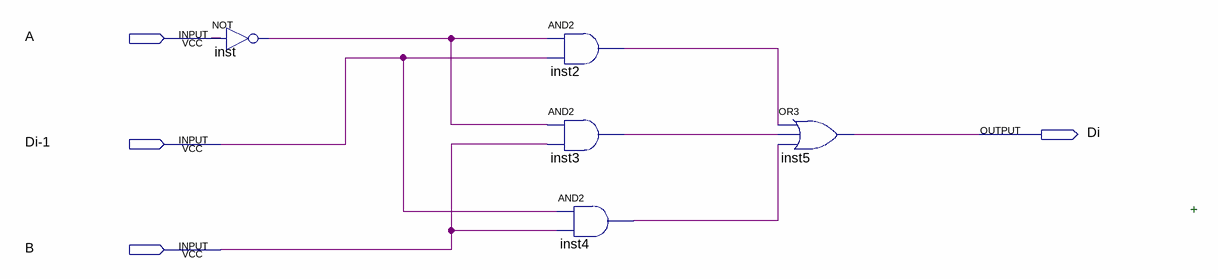
[diagram p0: schematic sheet]
// Quartus schematic Comp_menorQ_bit_a_bit.bdf as structural Verilog: 5 symbols, 4 pins
module Comp_menorQ_bit_a_bit (
  input  A,
  input  \Di-1 ,
  input  B,
  output Di
);

  wire inst2_out, inst3_out, inst4_out, inst_out;

  not inst (inst_out, A);
  and inst2 (inst2_out, inst_out, \Di-1 );
  and inst3 (inst3_out, inst_out, B);
  and inst4 (inst4_out, \Di-1 , B);
  or inst5 (Di, inst2_out, inst3_out, inst4_out);

  // Notes on the sheet:
  //   +
endmodule
